# EAGLE schematic 1transmitter (EAGLE 7.2.0)
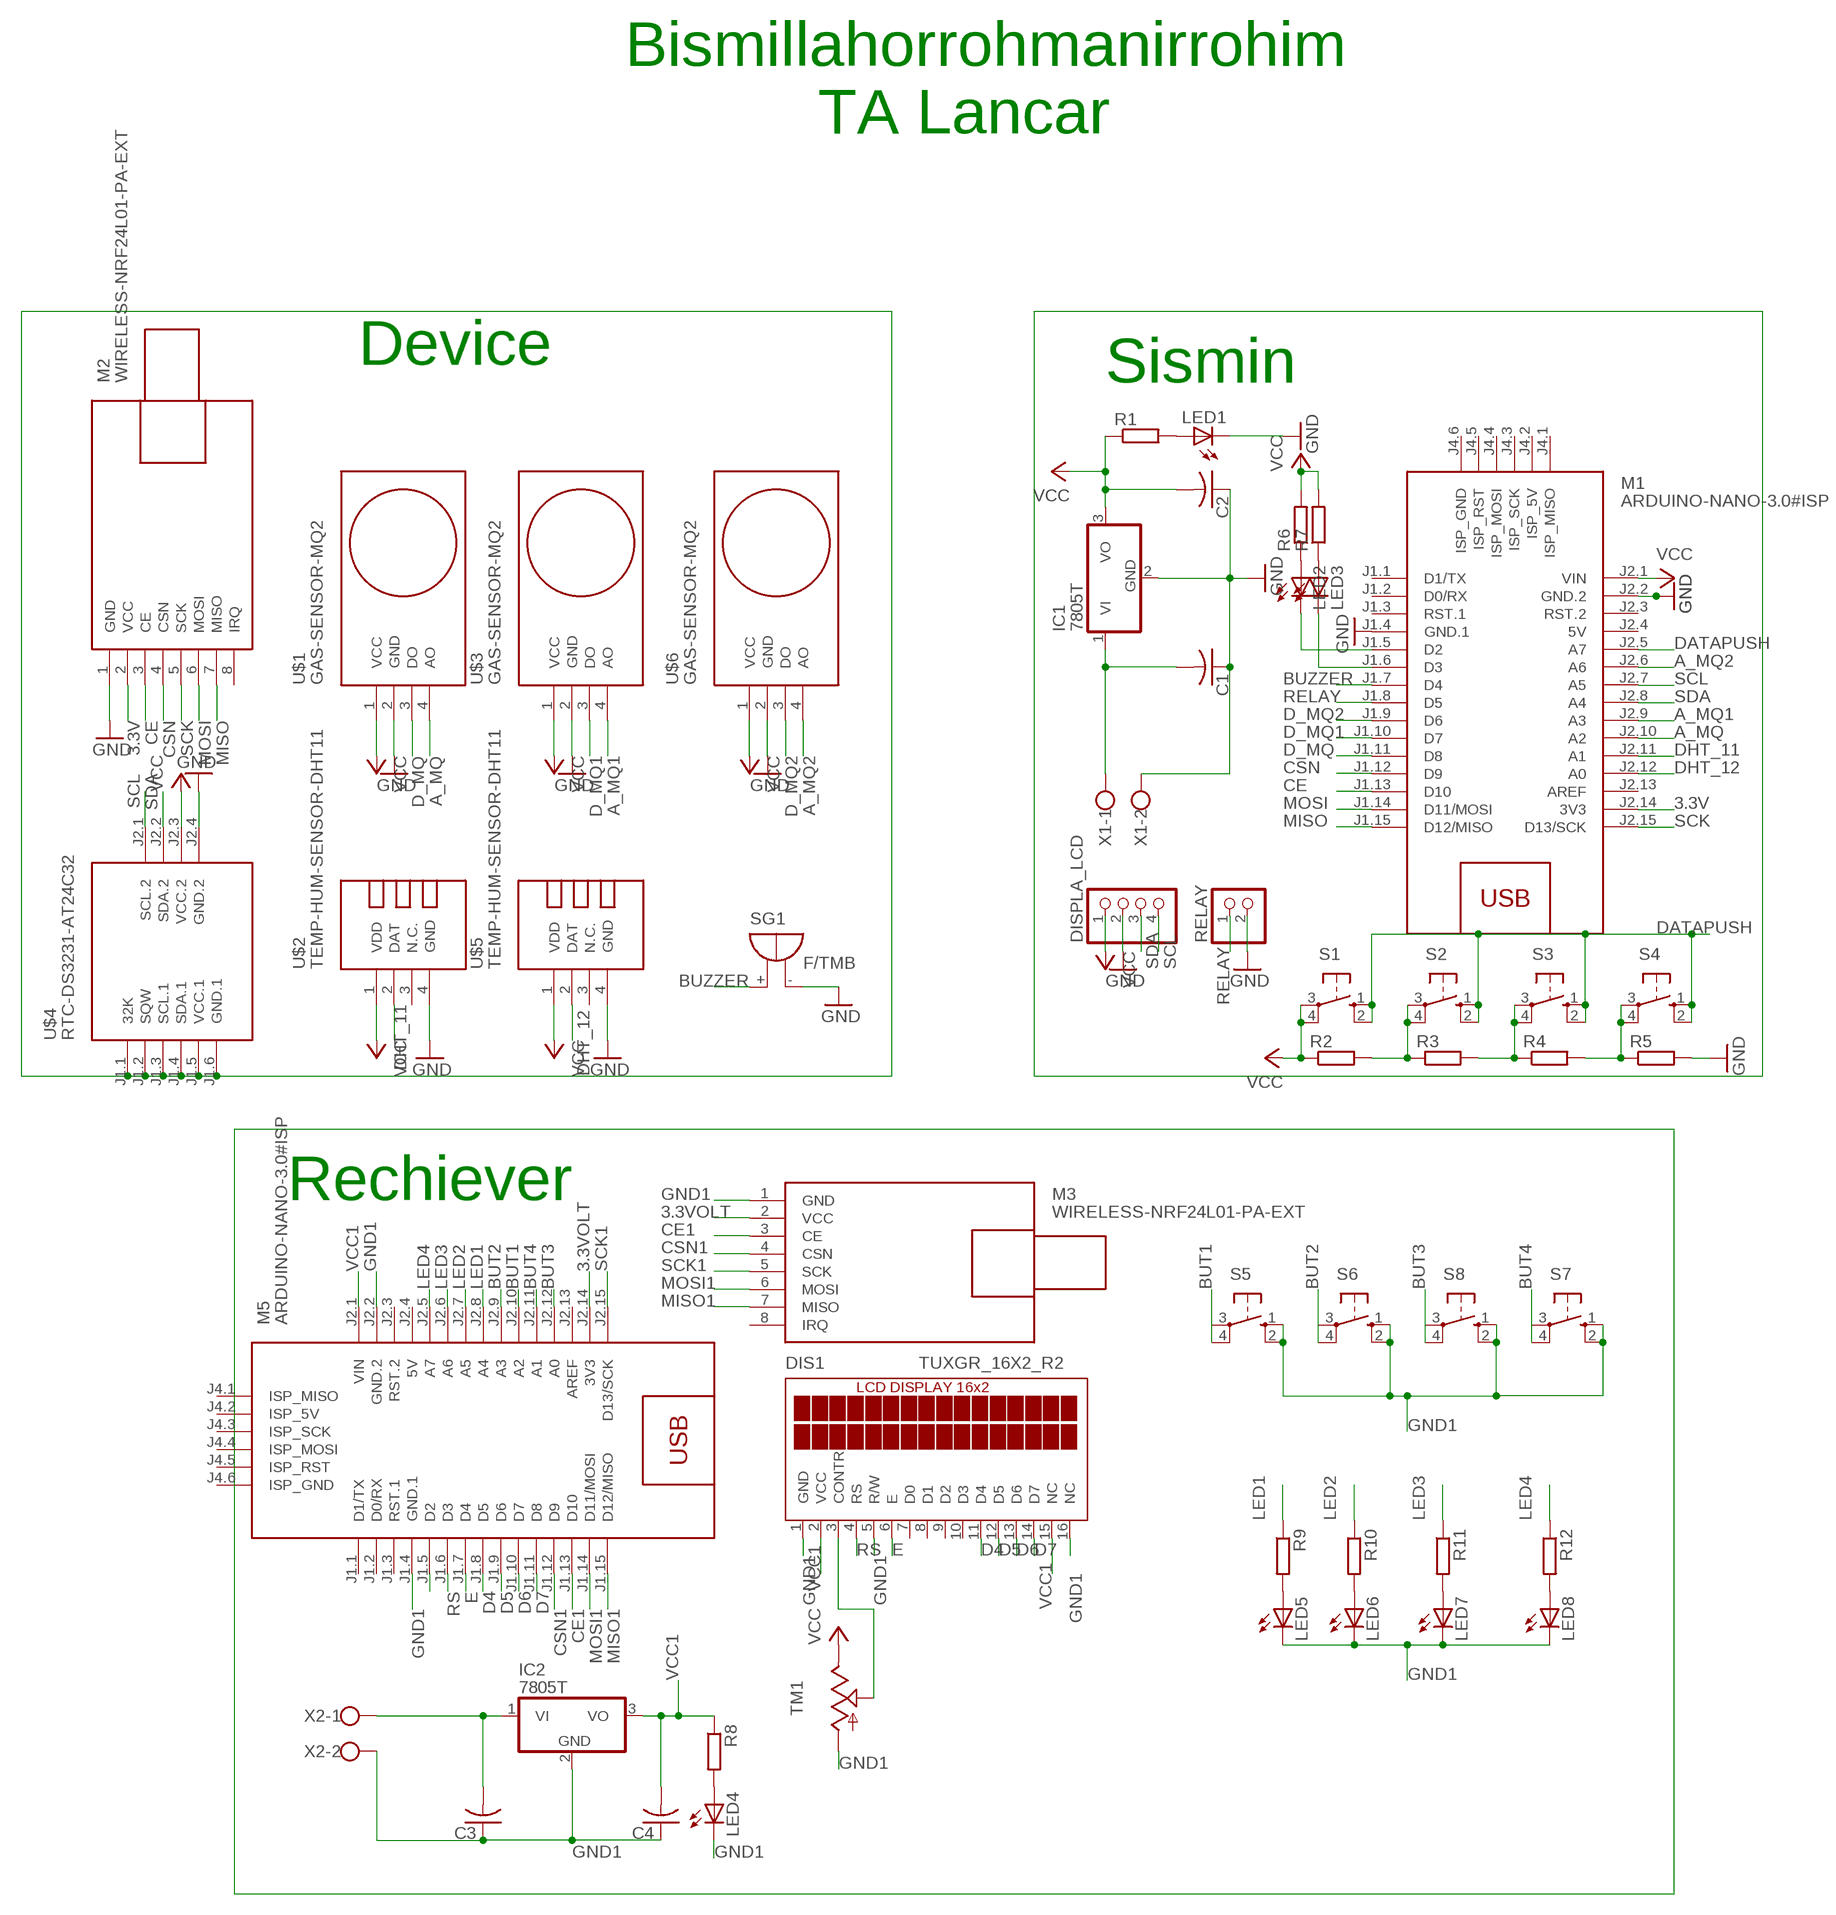
[diagram p0: schematic, sheet 1]

## Parts
C1  C-US025-050X050  [C025-050X050]
C2  C-US025-050X050  [C025-050X050]
C3  C-US025-050X050  [C025-050X050]
C4  C-US025-050X050  [C025-050X050]
DIS1  TUXGR_16X2_R2  [TUXGR_16X2_R2]
DISPLA_LCD  PINHD-1X4  [1X04]
IC1  7805T  [TO220H]
IC2  7805T  [TO220H]
LED1  LED3MM  [LED3MM]
LED2  LED3MM  [LED3MM]
LED3  LED3MM  [LED3MM]
LED4  LED3MM  [LED3MM]
LED5  LED5MM  [LED5MM]
LED6  LED5MM  [LED5MM]
LED7  LED5MM  [LED5MM]
LED8  LED5MM  [LED5MM]
M1  ARDUINO-NANO-3.0#ISP  [ARDUINO-NANO-3.0#ISP]
M2  WIRELESS-NRF24L01-PA-EXT  [WIRELESS-NRF24L01-PA-EXT]
M3  WIRELESS-NRF24L01-PA-EXT  [WIRELESS-NRF24L01-PA-EXT]
M5  ARDUINO-NANO-3.0#ISP  [ARDUINO-NANO-3.0#ISP]
R1  R-EU_0207/7  [0207/7]
R2  R-EU_0207/7  [0207/7]
R3  R-EU_0207/7  [0207/7]
R4  R-EU_0207/7  [0207/7]
R5  R-EU_0207/7  [0207/7]
R6  R-EU_0207/7  [0207/7]
R7  R-EU_0207/7  [0207/7]
R8  R-EU_0207/7  [0207/7]
R9  R-EU_0207/7  [0207/7]
R10  R-EU_0207/7  [0207/7]
R11  R-EU_0207/7  [0207/7]
R12  R-EU_0207/7  [0207/7]
RELAY  PINHD-1X2  [1X02]
S1  10-XX  [B3F-10XX]
S2  10-XX  [B3F-10XX]
S3  10-XX  [B3F-10XX]
S4  10-XX  [B3F-10XX]
S5  10-XX  [B3F-10XX]
S6  10-XX  [B3F-10XX]
S7  10-XX  [B3F-10XX]
S8  10-XX  [B3F-10XX]
SG1  F/TMB  [F/TMB]
TM1  TRIM  [6MM]
U$1  GAS-SENSOR-MQ2  [GAS-SENSOR-MQ2]
U$2  TEMP-HUM-SENSOR-DHT11  [TEMP-HUM-SENSOR-DHT11]
U$3  GAS-SENSOR-MQ2  [GAS-SENSOR-MQ2]
U$4  RTC-DS3231-AT24C32  [RTC-DS3231-AT24C32]
U$5  TEMP-HUM-SENSOR-DHT11  [TEMP-HUM-SENSOR-DHT11]
U$6  GAS-SENSOR-MQ2  [GAS-SENSOR-MQ2]
X1  W237-102  [W237-102]
X2  W237-102  [W237-102]

## Nets
3.3V: M1.J2.14(3V3) M2.2(VCC)
3.3VOLT: M3.2(VCC) M5.J2.14(3V3)
A_MQ: M1.J2.10(A2) U$1.4(AO)
A_MQ1: M1.J2.9(A3) U$3.4(AO)
A_MQ2: M1.J2.6(A6) U$6.4(AO)
BUT1: M5.J2.10(A2) S5.4(P1)
BUT2: M5.J2.9(A3) S6.4(P1)
BUT3: M5.J2.12(A0) S8.4(P1)
BUT4: M5.J2.11(A1) S7.4(P1)
BUZZER: M1.J1.7(D4) SG1.+
CE: M1.J1.13(D10) M2.3(CE)
CE1: M3.3(CE) M5.J1.13(D10)
CSN: M1.J1.12(D9) M2.4(CSN)
CSN1: M3.4(CSN) M5.J1.12(D9)
D4: DIS1.11(D4) M5.J1.8(D5)
D5: DIS1.12(D5) M5.J1.9(D6)
D6: DIS1.13(D6) M5.J1.10(D7)
D7: DIS1.14(D7) M5.J1.11(D8)
D_MQ: M1.J1.11(D8) U$1.3(DO)
D_MQ1: M1.J1.10(D7) U$3.3(DO)
D_MQ2: M1.J1.9(D6) U$6.3(DO)
DATAPUSH: M1.J2.5(A7) S1.1(S) S1.2(S1) S2.1(S) S2.2(S1) S3.1(S) S3.2(S1) S4.1(S) S4.2(S1)
DHT_11: M1.J2.11(A1) U$2.2(DAT)
DHT_12: M1.J2.12(A0) U$5.2(DAT)
E: DIS1.6(E) M5.J1.7(D4)
GND: C1.1 C2.1 DISPLA_LCD.2 IC1.2(GND) LED1.K(C) M1.J1.4(GND.1) M1.J2.2(GND.2) M2.1(GND) R5.2 RELAY.2 SG1.- U$1.2(GND) U$2.4(GND) U$3.2(GND) U$4.J2.4(GND.2) U$5.4(GND) U$6.2(GND) X1.2
GND1: C3.1 C4.1 DIS1.1(GND) DIS1.5(R/W) DIS1.16(NC) LED4.K(C) LED5.K(C) LED6.K(C) LED7.K(C) LED8.K(C) M3.1(GND) M5.J1.4(GND.1) M5.J2.2(GND.2) S5.1(S) S5.2(S1) S6.1(S) S6.2(S1) S7.1(S) S7.2(S1) S8.1(S) S8.2(S1) TM1.A X2.2
LED1: M5.J2.8(A4) R9.1
LED2: M5.J2.7(A5) R10.1
LED3: M5.J2.6(A6) R11.1
LED4: M5.J2.5(A7) R12.1
MISO: M1.J1.15(D12/MISO) M2.7(MISO)
MISO1: M3.7(MISO) M5.J1.15(D12/MISO)
MOSI: M1.J1.14(D11/MOSI) M2.6(MOSI)
MOSI1: M3.6(MOSI) M5.J1.14(D11/MOSI)
N$1: C1.2 IC1.1(VI) X1.1
N$2: LED1.A R1.2
N$3: U$4.J1.1(32K) U$4.J1.2(SQW) U$4.J1.3(SCL.1) U$4.J1.4(SDA.1) U$4.J1.5(VCC.1) U$4.J1.6(GND.1)
N$4: LED2.A R6.1
N$5: R2.2 R3.1 S2.3(P) S2.4(P1)
N$6: LED3.A R7.1
N$7: R3.2 R4.1 S3.3(P) S3.4(P1)
N$8: LED2.K(C) M1.J1.5(D2)
N$9: R4.2 R5.1 S4.3(P) S4.4(P1)
N$10: LED3.K(C) M1.J1.6(D3)
N$11: C3.2 IC2.1(VI) X2.1
N$12: LED4.A R8.2
N$13: DIS1.3(CONTR) TM1.S
N$14: M5.J1.5(D2)
N$24: LED5.A R9.2
N$25: LED6.A R10.2
N$26: LED7.A R11.2
N$27: LED8.A R12.2
RELAY: M1.J1.8(D5) RELAY.1
RS: DIS1.4(RS) M5.J1.6(D3)
SCK: M1.J2.15(D13/SCK) M2.5(SCK)
SCK1: M3.5(SCK) M5.J2.15(D13/SCK)
SCL: DISPLA_LCD.4 M1.J2.7(A5) U$4.J2.1(SCL.2)
SDA: DISPLA_LCD.3 M1.J2.8(A4) U$4.J2.2(SDA.2)
VCC: C2.2 DISPLA_LCD.1 IC1.3(VO) M1.J2.1(VIN) R1.1 R2.1 R6.2 R7.2 S1.3(P) S1.4(P1) TM1.E U$1.1(VCC) U$2.1(VDD) U$3.1(VCC) U$4.J2.3(VCC.2) U$5.1(VDD) U$6.1(VCC)
VCC1: C4.2 DIS1.15(NC) IC2.3(VO) R8.1
Unconnected: DIS1.7(D0) DIS1.8(D1) DIS1.9(D2) DIS1.10(D3) IC2.2(GND) M1.J1.1(D1/TX) M1.J1.2(D0/RX) M1.J1.3(RST.1) M1.J2.3(RST.2) M1.J2.13(AREF) M1.J4.1(ISP_MISO) M1.J4.2(ISP_5V) M1.J4.3(ISP_SCK) M1.J4.4(ISP_MOSI) M1.J4.5(ISP_RST) M1.J4.6(ISP_GND) M2.8(IRQ) M3.8(IRQ) M5.J1.1(D1/TX) M5.J1.2(D0/RX) M5.J1.3(RST.1) M5.J2.3(RST.2) M5.J2.13(AREF) M5.J4.1(ISP_MISO) M5.J4.2(ISP_5V) M5.J4.3(ISP_SCK) M5.J4.4(ISP_MOSI) M5.J4.5(ISP_RST) M5.J4.6(ISP_GND) S5.3(P) S6.3(P) S7.3(P) S8.3(P) U$2.3(N.C.) U$5.3(N.C.)

## Notes on the sheet
- Bismillahorrohmanirrohim
             TA Lancar
- Device | Sismin
- Rechiever

## Power pins joined to a net without a drawn wire
5V: M1.J2.4(5V) M5.J2.4(5V)
VCC: DIS1.2(VCC)
VIN: M5.J2.1(VIN)

## Library data of the parts
C1-C4 = adafruit:C-US: CAPACITOR, American symbol
DIS1 = display-lcd:TUXGR_16X2_R2: Tuxgraphics LCD display 16x2 characters reflective, without background light Source: tuxgr_12x2_r2.pdf; OC_FARNELL: unknown; OC_NEWARK: unknown
DISPLA_LCD = pinhead:PINHD-1X4: PIN HEADER
IC1 IC2 = adafruit:78*: Positive VOLTAGE REGULATOR Added bigger pads to the TO-92 package
LED1-LED8 = adafruit:LED: LED OSRAM: - CHIPLED LG R971, LG N971, LY N971, LG Q971, LY Q971, LO R971, LY R971 LH N974, LH R974 LS Q976, LO Q976, LY Q976 LO Q996 - Hyper CHIPLED LW Q18S LB Q993, LB Q99A, LB R99A - SideLED LS A670, LO A670, LY A670, LG A670, LP A670 LB A673, LV A673, LT A673, LW A673 LH A674 LY A675 LS A676, LA A676, LO A676, LY A676, LW A676 LS A679, LY A679, LG A679 - Hyper Micro SIDELED® LS Y876, LA Y876, LO Y876, LY Y876 LT Y87S - SmartLED LW L88C, LW L88S LB L89C, LB L89S, LG L890 LS L89K, LO L89K, LY L89K LS L896, LA L896, LO L896, LY L896 - TOPLED LS T670, LO T670, LY T670, LG T670, LP T670 LSG T670, LSP T670, LSY T670, LOP T670, LYG T670 LG T671, LOG T671, LSG T671 LB T673, LV T673, LT T673, LW T673 LH T674 LS T676, LA T676, LO T676, LY T676, LB T676, LH T676, LSB T676, LW T676 LB T67C, LV T67C, LT T67C, LS T67K, LO T67K, LY T67K, LW E67C LS E67B, LA E67B, LO E67B, LY E67B, LB E67C, LV E67C, LT E67C LW T67C LS T679, LY T679, LG T679 LS T770, LO T770, LY T770, LG T770, LP T770 LB T773, LV T773, LT T773, LW T773 LH T774 LS E675, LA E675, LY E675, LS T675 LS T776, LA T776, LO T776, LY T776, LB T776 LHGB T686 LT T68C, LB T68C - Hyper Mini TOPLED® LB M676 - Mini TOPLED Santana® LG M470 LS M47K, LO M47K, LY M47K Source: http://www.osram.convergy.de/
M1 M5 = diy-modules:ARDUINO-NANO-3.0#ISP: Arduino Nano 3.0 (and compatible devices) with ISP pads More details available here: https://www.arduino.cc/en/Main/ArduinoBoardNano Click here to find device on ebay.com <http://www.ebay.com/sch/arduino+nano>
M2 M3 = diy-modules:WIRELESS-NRF24L01-PA-EXT: 2.4 GHz Wireless Module based on NRF24L01 chip with preamplifier and external antenna Click here to find device on ebay.com <http://www.ebay.com/sch/nrf24l01+pa+lna+sma>
R1-R12 = rcl:R-EU_: RESISTOR, European symbol
RELAY = pinhead:PINHD-1X2: PIN HEADER
S1-S8 = switch-omron:10-XX: OMRON SWITCH; MPN: B3F-1000; OC_FARNELL: 176432; OC_NEWARK: 36M3542
SG1 = buzzer:F/TMB: BUZZER Source: Buerklin; OC_FARNELL: unknown; OC_NEWARK: unknown
TM1 = adafruit:TRIM
U$1 U$3 U$6 = diy-modules:GAS-SENSOR-MQ2: Gas Sensor based on MQ-2 device Guide describing how to use MQ-2 sensor with Arduino is available here: http://www.instructables.com/id/How-to-use-MQ2-Gas-Sensor-Arduino-Tutorial/ MQ-2 sensor datasheet is available here: http://gas-sensor.ru/pdf/combustible-gas-sensor.pdf Click here to find device on ebay.com <http://www.ebay.com/sch/mq2+sensor+module+smoke>
U$2 U$5 = diy-modules:TEMP-HUM-SENSOR-DHT11: DHT11 - digital humidity & temperature sensor DHT11 datasheet available here: https://akizukidenshi.com/download/ds/aosong/DHT11.pdf Click here to find device on ebay.com <http://www.ebay.com/sch/dht11+digital+sensor>
U$4 = diy-modules(1):RTC-DS3231-AT24C32: RTC Module with Battery and EEPROM based on DS3231 and AT24C32 chips Tutorial can be found here: https://edwardmallon.wordpress.com/2014/05/21/using-a-cheap-3-ds3231-rtc-at24c32-eeprom-from-ebay/ Click here to find device on ebay.com <http://www.ebay.com/sch/DS3231+AT24C32+module>
X1 X2 = con-wago-500:W237-102: WAGO SCREW CLAMP; MPN: 237-102; OC_FARNELL: unknown; OC_NEWARK: 70K9898